# EAGLE design mp3431-boost-tester-mk-2.0.0 (EAGLE 9.2.2)
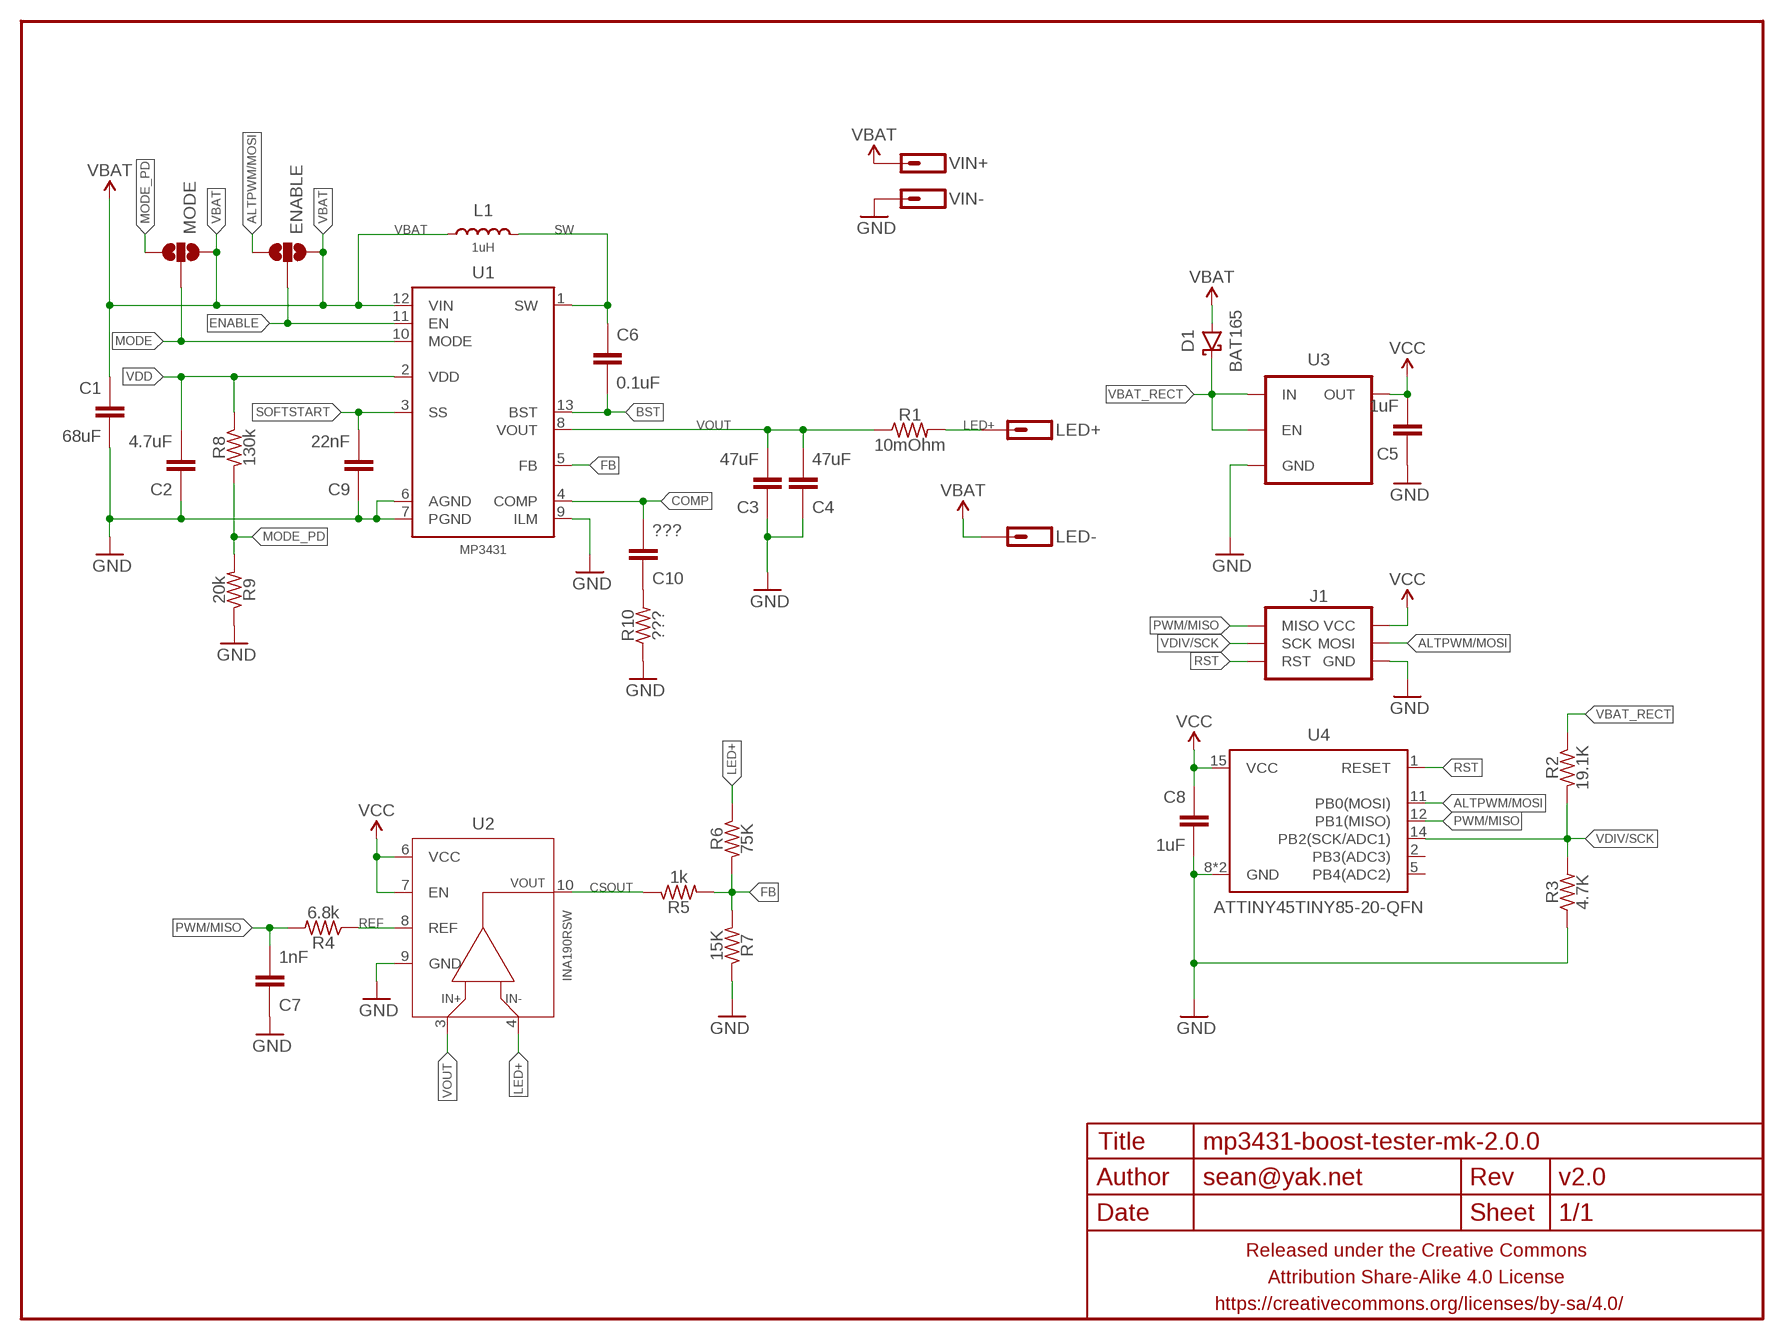
[diagram p0: schematic, sheet 1]

## Parts
C1  68uF  CAPACITOR-CERAMICC1206  [C1206]
C2  4.7uF  CAPACITOR-CERAMICC0402  [C0402]
C3  47uF  CAPACITOR-CERAMICC1206  [C1206]
C4  47uF  CAPACITOR-CERAMICC1206  [C1206]
C5  1uF  CAPACITOR-CERAMICC0402  [C0402]
C6  0.1uF  CAPACITOR-CERAMICC0402  [C0402]
C7  1nF  CAPACITOR-CERAMICC0402  [C0402]
C8  1uF  CAPACITOR-CERAMICC0402  [C0402]
C9  22nF  CAPACITOR-CERAMICC0402  [C0402]
C10  ???  CAPACITOR-CERAMICC0402  [C0402]
D1  BAT165  DIODE-SCHOTTKYSOD323  [SOD323-SCHOTTKY]
ENABLE  JUMPER-PAD-3-NOSMALL_BOX_SILK  [PAD-JUMPER-3-NO_YES_SILK_SMALL_BOX]
FRAME1  FRAME-LETTERNO_PACKAGE  [DUMMY]
J1  AVR_SPI_PRG_6SMD-1.27MM  [2X3-1.27MM-SMD]
L1  1uH  INDUCTORXAL7070  [XAL7070]
LED+  M01PTH-1.2MM-NS  [1X01-1.2MM-NS]
LED-  M01PTH-1.2MM-NS  [1X01-1.2MM-NS]
MODE  JUMPER-PAD-3-NOSMALL_BOX_SILK  [PAD-JUMPER-3-NO_YES_SILK_SMALL_BOX]
R1  10mOhm  RESISTORR1206  [R1206]
R2  19.1K  RESISTORR0402  [R0402]
R3  4.7K  RESISTORR0402  [R0402]
R4  6.8k  RESISTORR0402  [R0402]
R5  1k  RESISTORR0402  [R0402]
R6  75K  RESISTORR0402  [R0402]
R7  15K  RESISTORR0402  [R0402]
R8  130k  RESISTORR0402  [R0402]
R9  20k  RESISTORR0402  [R0402]
R10  ???  RESISTORR0402  [R0402]
U1  MP3431  [MP3431]
U2  INA190RSW  [UQFN-10]
U3  V_REG_ENTLV700  [SC70]
U4  ATTINY45TINY85-20-QFN  [QFN20]
VIN+  M01PTH-1.2MM-NS  [1X01-1.2MM-NS]
VIN-  M01PTH-1.2MM-NS  [1X01-1.2MM-NS]

## Nets
ALTPWM/MOSI: ENABLE.3 J1.4(MOSI) U4.11(PB0(MOSI))
BST: C6.2 U1.13(BST)
COMP: C10.2 U1.4(COMP)
COMP_MID: C10.1 R10.2
CSOUT: R5.1 U2.10(OUT)
ENABLE: ENABLE.2 U1.11(EN)
FB: R5.2 R6.2 R7.2 U1.5(FB)
GND: C1.2 C2.1 C3.1 C4.1 C5.1 C7.1 C8.2 C9.1 J1.6(GND) R3.1 R7.1 R9.1 R10.1 U1.6(AGND) U1.7(PGND) U1.9(ILM) U2.9(GND) U3.2(GND) U4.8(GND) U4.PAD(GND) VIN-.P$1
LED+: LED+.P$1 R1.2 R6.1 U2.4(VIN-)
MODE: MODE.2 U1.10(MODE)
MODE_PD: MODE.3 R8.2 R9.2
PWM/MISO: C7.2 J1.1(MISO) R4.2 U4.12(PB1(MISO))
REF: R4.1 U2.8(REF)
RST: J1.5(RST) U4.1(RESET)
SOFTSTART: C9.2 U1.3(SS)
SW: C6.1 L1.P$2 U1.1(SW)
VBAT: C1.1 D1.A ENABLE.1 L1.P$1 LED-.P$1 MODE.1 U1.12(VIN) VIN+.P$1
VBAT_RECT: D1.C R2.1 U3.1(IN) U3.3(EN)
VCC: C5.2 C8.1 J1.2(VCC) U2.6(VCC) U2.7(EN) U3.5(OUT) U4.15(VCC)
VDD: C2.2 R8.1 U1.2(VDD)
VDIV/SCK: J1.3(SCK) R2.2 R3.2 U4.14(PB2(SCK/ADC1))
VOUT: C3.2 C4.2 R1.1 U1.8(VOUT) U2.3(VIN+)
Unconnected: U4.2(PB3(ADC3)) U4.5(PB4(ADC2))

## Library data of the parts
C1-C10 = a_parts:CAPACITOR-CERAMIC: CAPACITOR, European symbol
D1 = a_parts:DIODE-SCHOTTKY: Schottky diodes in SFE's production catalog BAT20J 1A 23V 0.62Vf RB751 120mA 40V 0.37Vf PMEG4005EJ 0.5A 40V 0.42Vf MBRA140 1A 40V 0.5Vf B340A 3A 40V SMA
ENABLE MODE = a_parts:JUMPER-PAD-3-NO
FRAME1 = a_parts:FRAME-LETTER: Schematic Frame Standard 8.5x11 US Letter frame; DESIGNER: sean@yak.net; VERSION: v2.0
J1 = a_parts:AVR_SPI_PRG_6: AVR ISP 6 Pin This is the reduced ISP connector for AVR programming. Common on Arduino. This footprint will take up less PCB space and can be used with a 10-pin to 6-pin adapter such as SKU: BOB-08508 **Special note about "TEST_POINT" package. The stop mask is on the top side, so if you want your programming test points to be on the bottom of your board, make sure to place this package on the bottom side of the board. This also ensure that the orientation to program from the bottom side will be correct.
L1 = a_parts:INDUCTOR: Inductors Basic Inductor/Choke - 0603 and 1206. Footprints are not proven and vary greatly between part numbers. SRN6045- 33uH, 20% 1.4A SDR0403-560KL - 56uH, 10%, 500mA RMS/740mA peak
LED+ LED- VIN+ VIN- = a_parts:M01: Header 1 Standard 1-pin 0.1" header. Use with straight break away headers (SKU : PRT-00116), right angle break away headers (PRT-00553), swiss pins (PRT-00743), machine pins (PRT-00117), and female headers (PRT-00115).
R1-R10 = a_parts:RESISTOR: RESISTOR, American symbol
U1 = a_parts:MP3431
U2 = a_parts:INA190
U3 = a_parts:V_REG_EN
U4 = a_parts:ATTINY45: Atmel 8-pin 2/4/8kB flash uC

## Board
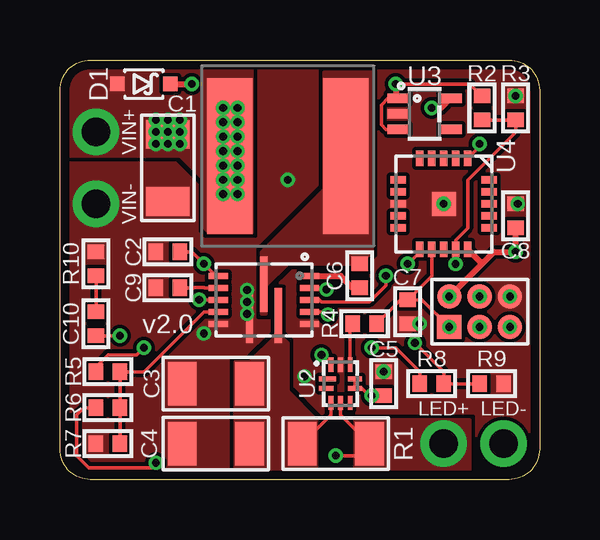
[diagram p1: board, top side]
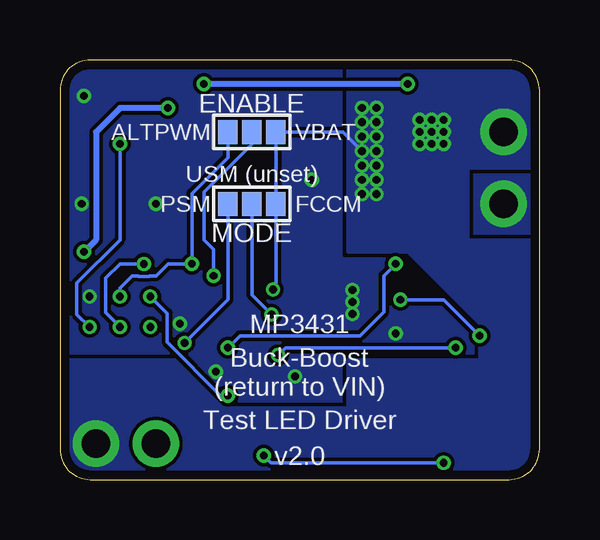
[diagram p2: board, bottom side, seen from below]

Size 20 x 17.5 mm. Coordinates in mm from the lower left corner, seen from the top.
Outline: 18.73,0 1.27,0 arc-90 0,1.27 0,16.23 arc-90 1.27,17.5 18.73,17.5 arc-90 20,16.23 20,1.27 arc-90 18.73,0
Copper layers (1*16): Top 0.035559375mm / dielectric 1.6mm / Bottom 0.035559375mm
Design rules "oshpark-2layer": minimum track width 6mil, minimum drill 10mil, track to track 6mil, track to pad 6mil, pad to pad 6mil, via to via 6mil, smd to smd 0mil, copper to edge 15mil, drill to drill 6mil, minimum pad ring 5mil, minimum via ring 5mil, stop-mask expansion 2.5mil, vias tented up to drill 20mil, thermal gap 10mil

### Footprints (pad centres in the part's own frame; a part is rotated, then mirrored left to right if it is on the bottom)
C1206 = smd 1.2 x 1.8: 1 -1.4,0; 2 1.4,0
C0402 = smd 0.6 x 0.7: 1 -0.5,0; 2 0.5,0
SOD323-SCHOTTKY = smd 0.6 x 0.6: A -1.1,0; C 1.1,0
PAD-JUMPER-3-NO_YES_SILK_SMALL_BOX = smd 0.8 x 1: 1 -1,0; 2 0,0; 3 1,0
2X3-1.27MM-SMD = smd 1.016 x 1.016: 1 -1.27,-0.635; 2 -1.27,0.635; 3 0,-0.635; 4 0,0.635; 5 1.27,-0.635; 6 1.27,0.635
XAL7070 = smd 1.9 x 6.5: P$1 -2.41,0; P$2 2.41,0
1X01-1.2MM-NS = drill 1.2 pad 1.93: P$1 0,0
R1206 = smd 1.2 x 1.8: 1 -1.4,0; 2 1.4,0
R0402 = smd 0.6 x 0.7: 1 -0.5,0; 2 0.5,0
MP3431 = smd 2.3 x 0.3: 1 -0.65,0; 7 0.65,-0.6; 8 0.65,0.6 | smd 0.25 x 0.8: 2 -1,-1.9; 3 -0.5,-1.9; 4 0,-1.9; 5 0.5,-1.9; 6 1,-1.9; 9 1,1.9; 10 0.5,1.9; 11 0,1.9; 12 -0.5,1.9; 13 -1,1.9
UQFN-10 = smd 0.2 x 0.7: 1 -0.2,-0.55 | smd 0.2 x 0.6: 2 0.2,-0.6; 6 0.2,0.6; 7 -0.2,0.6 | smd 0.6 x 0.2: 3 0.8,-0.4; 4 0.8,0; 5 0.8,0.4; 8 -0.8,0.4; 9 -0.8,0; 10 -0.8,-0.4
SC70 = smd 0.4 x 0.9: 1 -0.65,-1.1; 2 0,-1.1; 3 0.65,-1.1; 4 0.65,1.1; 5 -0.65,1.1
QFN20 = smd 0.65 x 0.3: 1 -1.9,1; 2 -1.9,0.5; 3 -1.9,0; 4 -1.9,-0.5; 5 -1.9,-1; 11 1.9,-1; 12 1.9,-0.5; 13 1.9,0; 14 1.9,0.5; 15 1.9,1 | smd 0.3 x 0.65: 6 -1,-1.9; 7 -0.5,-1.9; 8 0,-1.9; 9 0.5,-1.9; 10 1,-1.9; 16 1,1.9; 17 0.5,1.9; 18 0,1.9; 19 -0.5,1.9; 20 -1,1.9 | smd 1 x 1: PAD 0,0

### Placement (x,y rotation side)
C1  4.5,13 270 top
C2  4.5,9.5 0 top
C3  6.5,4 0 top
C4  6.5,1.5 0 top
C5  13.5,4 270 top
C6  12.5,8.5 270 top
C7  14.5,7 90 top
C8  19,11 90 top
C9  4.5,8 0 top
C10  1.5,6.5 270 top
D1  3.5,16.5 0 top
ENABLE  12,14.5 180 bottom
FRAME1  0,0 270 top
J1  17.5,7 0 top
L1  9.5,13.5 0 top
LED+  16,1.5 0 top
LED-  18.5,1.5 180 top
MODE  12,11.5 180 bottom
R1  11.5,1.5 0 top
R2  17.6,15.5 270 top
R3  19,15.5 270 top
R4  12.7,6.5 0 top
R5  2,4.5 0 top
R6  2,3 0 top
R7  2,1.5 0 top
R8  15.5,4 0 top
R9  18,4 180 top
R10  1.5,9 270 top
U1  8.5,7.5 270 top
U2  11.7,4 270 top
U3  15.2,15.25 270 top
U4  16,11.5 270 top
VIN+  1.5,14.5 270 top
VIN-  1.5,11.5 270 top

### Tracks (layer width: path | path; a pad name or v marks a point on that pad's centre or on a via)
ALTPWM/MOSI  (via drill 0.33)
  Top 0.152: U4.11 15,9.5 v14.5,9
  Bottom 0.152: J1.4 17.5,8 17,8.5 16.74,8.5 16.72,8.48 16.28,8.48 16.26,8.5 16,8.5 15.5,9 v14.5,9 14.5,11.93 13,13.43 ENABLE.3
  other vias: 17.5,7.63
BST
  Top 0.25: U1.13 11.7,8.5 12.2,8 C6.2
COMP  (via drill 0.33)
  Top 0.152: U1.4 v5.8,7.5 | v2.5,6 C10.2
  Bottom 0.152: v5.8,7.5 4,7.5 v2.5,6
COMP_MID
  Top 0.152: C10.1 R10.2
CSOUT  (via drill 0.33)
  Top 0.152: U2.10 v10.9,5.2 | v3.5,5.5 3.2,5.2 2,5.2 1.5,4.7 R5.1
  Bottom 0.152: v10.9,5.2 10.6,5.5 v3.5,5.5
ENABLE  (via drill 0.33)
  Top 0.152: v13.6,8.5 13.6,8.1 12.91,7.41 10.91,7.41 10.82,7.5 U1.11
  Bottom 0.152: v13.6,8.5 13.6,9.6 14,10 14,12 12,14 ENABLE.2
FB
  Top 0.152: R7.2 R6.2 R5.2 3.5,4.5 6,7 U1.5
GND  (via drill 0.33)
  other vias: 18.77,7.63 13.5,4.5 19.1,11.5 19,16 10.2,4.3 16,11.5 9.5,12.5 7.8,7.9 7.8,7.4 7.8,6.9 15,6.5 6,6.1
  pour Top (rank 6, no thermals): 0,0 0,17.5 20,17.5 20,0
  pour Bottom (rank 6, no thermals): 20,0 20,17.4 20,17.5 0,17.5 0,0
LED+  (via drill 0.33)
  Top 0.152: U2.4 11.7,2.7 R1.2 12.4,1 v11.5,1 | R6.1 1,3 0.7,2.7 0.7,1 1.2,0.5 3.8,0.5 v4,0.7
  Bottom 0.152: v11.5,1 11.2,0.7 v4,0.7
  pour Top (rank 4, no thermals): 12.3,2.5 17.1,2.5 17.1,0 12.3,0
MODE  (via drill 0.33)
  Top 0.152: U1.10 11.05,7 v11.18,6.88
  Bottom 0.152: v11.18,6.88 12,7.7 MODE.2
MODE_PD  (via drill 0.33)
  Top 0.152: R9.2 R8.2 16,4.5 v14.81,5.69 v14.81,5.7
  Bottom 0.152: v14.81,5.7 13,7.51 MODE.3
PWM/MISO  (via drill 0.33)
  Top 0.152: U4.12 15.5,8.5 C7.2 | C7.2 15.1,7.5 J1.1 | R4.2 14.2,7.5 C7.2
  other vias: 16.23,6.37
REF
  Top 0.152: U2.8 12.1,6.4 R4.1
RST  (via drill 0.33)
  Top 0.152: U4.1 17.5,13.9 v17.5,14
  Bottom 0.152: v17.5,14 17.5,10 19.3,8.2 19.3,6.89 J1.5
  other vias: 18.77,6.37
SOFTSTART
  Top 0.152: U1.3 6.04,8 6.02,8.02 5.58,8.02 5.56,8 C9.2
SW
  pour Top (rank 4, no thermals): 8.4,6.9 8.4,9.5 11,12.1 11,17 13,17 13,9.5 12.5,9 9.5,9 8.6,8.1 8.6,6.9
VBAT  (via drill 0.33)
  Top 0.152: U1.12 11.05,8 v11.12,7.93
  Bottom 0.152: v7.4,13.7 8.2,14.5 ENABLE.1 MODE.1 11,8.05 v11.12,7.93
  other vias: 4.5,14.5 7.4,15.5 6.8,15.5 6.8,14.9 7.4,14.9 7.4,14.3 7.4,13.1 7.4,12.5 7.4,11.9 6.8,11.9 6.8,12.5 6.8,13.1 6.8,13.7 6.8,14.3 5,14.5 4,14.5 4,14 4.5,14 5,14 4,15 4.5,15 5,15
  pour Top (rank 4, no thermals): 0,17.5 8,17.5 8,10.3 6.2,10.3 6,10.5 6,12.5 5,13.5 0,13.5
  pour Bottom (rank 4, no thermals): 0,17.5 8,17.5 8,9.5 5.5,9.5 2.5,6.5 2.5,5 8,5 8,3 13,3 15,5 20,5 20,0 0,0 0,10 3,10 3,13 0,13
VBAT_RECT  (via drill 0.33)
  Top 0.152: U3.3 13.6,14.6 13.4,14.8 13.4,15.62 13.68,15.9 U3.1 | R2.1 17.1,16.5 v14,16.5
  Top 0.25: D1.C v5.5,16.5 | v14,16.5 14,16 U3.1
  Bottom 0.25: v5.5,16.5 v14,16.5
VCC  (via drill 0.33)
  Top 0.152: U2.7 U2.6 12.6,3.8 12.9,3.5 C5.2 v13,3.5
  Top 0.25: U3.5 15.9,15.5 v15.5,15.5 | C8.1 v19,9.5 18.09,9.5 17.55,8.95 | J1.2 17.55,8.95 | U4.15 17.55,9.05 17.55,8.95
  Bottom 0.152: J1.2 15.53,6.93 15.53,5.73 13.3,3.5 v13,3.5
  Bottom 0.25: v15.5,15.5 17.5,15.5 18.5,14.5 18.5,10 v19,9.5
  other vias: 16.23,7.63
VDD  (via drill 0.33)
  Top 0.152: C2.2 5.5,9.5 v6,9 6.5,8.5 U1.2 | v13,5.5 14,5.5 15,4.5 R8.1
  Bottom 0.152: v6,9 6.5,8.5 6.5,7 7.5,6 12.5,6 v13,5.5
VDIV/SCK  (via drill 0.33)
  Top 0.152: v16.5,9 U4.14 16.5,10 17,10.5 17,12.5 19,14.5 R3.2 R2.2
  Bottom 0.152: v16.5,9 17.5,9 18.1,8.4 18.1,6.96 J1.3
  other vias: 17.5,6.37
VOUT
  Top 0.152: R1.1 11.3,2.7 U2.3
  pour Top (rank 4, no thermals): 9,7.9 9,6 7.9,4.9 7.3,4.9 7.3,0 10.7,0 10.7,2.5 9.5,3.7 9.5,5.7 9.2,6 9.2,7.9

### Text on the board
bPlace: VBAT | ALTPWM | FCCM | USM (unset) | PSM | MP3431 | Buck-Boost / (return to VIN) | Test LED Driver